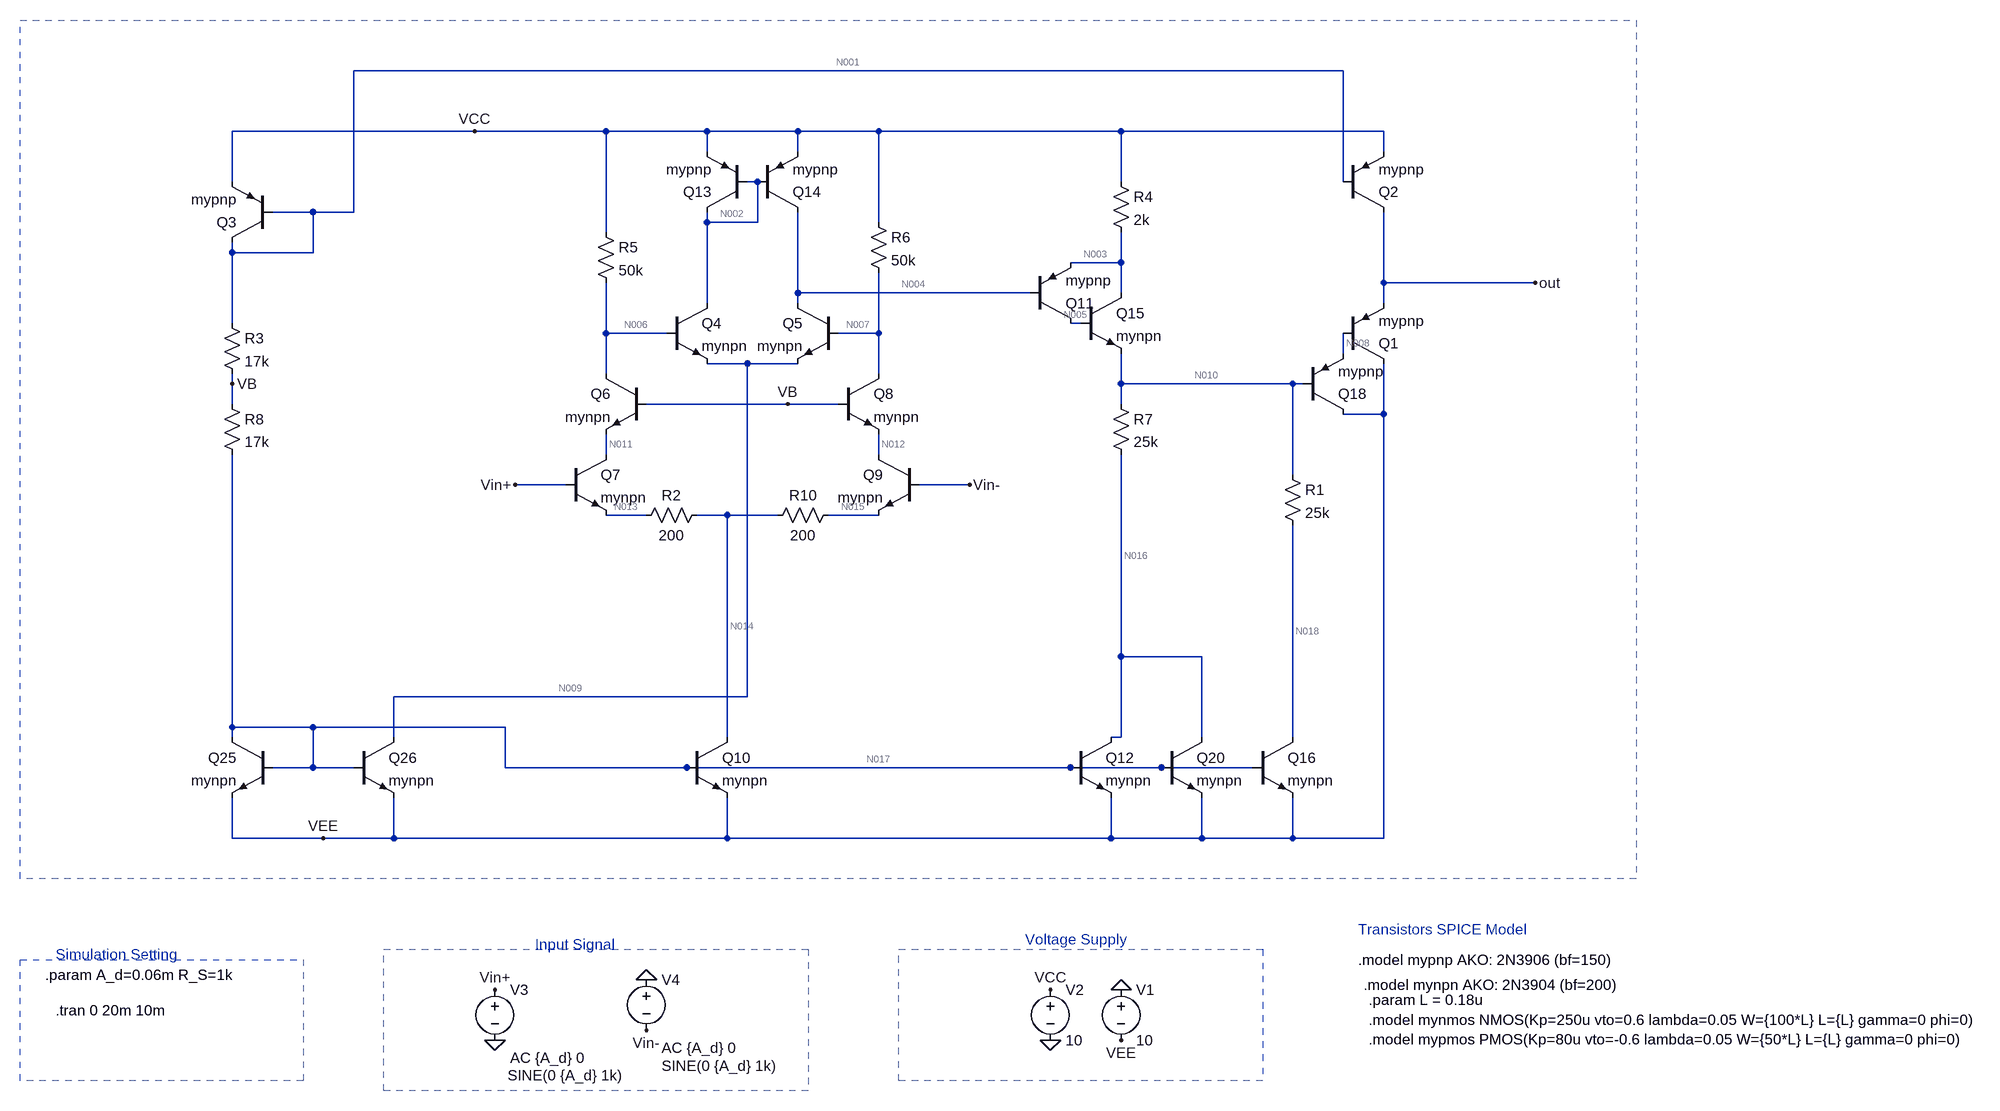
[diagram p0: schematic main.asc]
main.asc, the LTspice schematic file:
Version 4.1
SHEET 1 2940 1112
WIRE 1296 -512 -272 -512
WIRE -80 -416 -464 -416
WIRE 128 -416 -80 -416
WIRE 288 -416 128 -416
WIRE 432 -416 288 -416
WIRE 560 -416 432 -416
WIRE 944 -416 560 -416
WIRE 1360 -416 944 -416
WIRE 288 -384 288 -416
WIRE 432 -384 432 -416
WIRE 1360 -384 1360 -416
WIRE -464 -336 -464 -416
WIRE 368 -336 352 -336
WIRE 944 -336 944 -416
WIRE 1296 -336 1296 -512
WIRE -336 -288 -400 -288
WIRE -272 -288 -272 -512
WIRE -272 -288 -336 -288
WIRE 288 -272 288 -288
WIRE 368 -272 368 -336
WIRE 368 -272 288 -272
WIRE 560 -272 560 -416
WIRE 128 -256 128 -416
WIRE -464 -224 -464 -240
WIRE -336 -224 -336 -288
WIRE -336 -224 -464 -224
WIRE 944 -208 944 -256
WIRE 944 -208 864 -208
WIRE 1360 -176 1360 -288
WIRE 1600 -176 1360 -176
WIRE 432 -160 432 -288
WIRE 800 -160 432 -160
WIRE 944 -160 944 -208
WIRE 288 -144 288 -272
WIRE 432 -144 432 -160
WIRE 1360 -144 1360 -176
WIRE -464 -112 -464 -224
WIRE 880 -112 864 -112
WIRE 128 -96 128 -176
WIRE 224 -96 128 -96
WIRE 560 -96 560 -192
WIRE 560 -96 496 -96
WIRE 1296 -64 1296 -96
WIRE 352 -48 288 -48
WIRE 432 -48 352 -48
WIRE 128 -32 128 -96
WIRE 560 -32 560 -96
WIRE -464 -16 -464 -32
WIRE 944 -16 944 -64
WIRE 1216 -16 944 -16
WIRE 1232 -16 1216 -16
WIRE -464 16 -464 -16
WIRE 416 16 192 16
WIRE 496 16 416 16
WIRE 944 16 944 -16
WIRE 1360 32 1360 -48
WIRE 1360 32 1296 32
WIRE 128 96 128 64
WIRE 560 96 560 64
WIRE 1216 128 1216 -16
WIRE 64 144 -16 144
WIRE 704 144 624 144
WIRE 192 192 128 192
WIRE 320 192 272 192
WIRE 400 192 320 192
WIRE 560 192 480 192
WIRE 944 416 944 96
WIRE 1072 416 944 416
WIRE 352 480 352 -48
WIRE 352 480 -208 480
WIRE -464 528 -464 96
WIRE -336 528 -464 528
WIRE -32 528 -336 528
WIRE -464 544 -464 528
WIRE -208 544 -208 480
WIRE 320 544 320 192
WIRE 944 544 944 416
WIRE 944 544 928 544
WIRE 1072 544 1072 416
WIRE 1216 544 1216 208
WIRE -336 592 -336 528
WIRE -336 592 -400 592
WIRE -272 592 -336 592
WIRE -32 592 -32 528
WIRE 256 592 -32 592
WIRE 864 592 256 592
WIRE 1008 592 864 592
WIRE 1152 592 1008 592
WIRE -464 704 -464 640
WIRE -320 704 -464 704
WIRE -208 704 -208 640
WIRE -208 704 -320 704
WIRE 320 704 320 640
WIRE 320 704 -208 704
WIRE 928 704 928 640
WIRE 928 704 320 704
WIRE 1072 704 1072 640
WIRE 1072 704 928 704
WIRE 1216 704 1216 640
WIRE 1216 704 1072 704
WIRE 1360 704 1360 32
WIRE 1360 704 1216 704
FLAG 944 1024 VEE
FLAG 832 944 VCC
FLAG 832 1024 0
FLAG 944 944 0
FLAG -48 1024 0
FLAG -48 944 Vin+
FLAG -320 704 VEE
FLAG -80 -416 VCC
FLAG 416 16 VB
FLAG -464 -16 VB
FLAG -16 144 Vin+
FLAG 704 144 Vin-
FLAG 1600 -176 out
FLAG 192 928 0
FLAG 192 1008 Vin-
SYMBOL voltage 944 928 R0
WINDOW 123 0 0 Left 0
WINDOW 39 0 0 Left 0
SYMATTR InstName V1
SYMATTR Value 10
SYMBOL voltage 832 928 R0
WINDOW 123 0 0 Left 0
WINDOW 39 0 0 Left 0
SYMATTR InstName V2
SYMATTR Value 10
SYMBOL voltage -48 928 R0
WINDOW 123 24 124 Left 2
WINDOW 39 0 0 Left 0
WINDOW 3 20 151 Left 2
SYMATTR Value2 AC {A_d} 0
SYMATTR Value SINE(0 {A_d} 1k)
SYMATTR InstName V3
SYMBOL voltage 192 912 R0
WINDOW 123 24 124 Left 2
WINDOW 39 0 0 Left 0
WINDOW 3 24 152 Left 2
SYMATTR Value2 AC {A_d} 0
SYMATTR Value SINE(0 {A_d} 1k)
SYMATTR InstName V4
SYMBOL npn -400 544 M0
SYMATTR InstName Q25
SYMATTR Value mynpn
SYMBOL npn -272 544 R0
SYMATTR InstName Q26
SYMATTR Value mynpn
SYMBOL pnp -400 -240 R180
SYMATTR InstName Q3
SYMATTR Value mypnp
SYMBOL npn 224 -144 R0
SYMATTR InstName Q4
SYMATTR Value mynpn
SYMBOL npn 496 -144 M0
SYMATTR InstName Q5
SYMATTR Value mynpn
SYMBOL npn 192 -32 M0
SYMATTR InstName Q6
SYMATTR Value mynpn
SYMBOL npn 64 96 R0
SYMATTR InstName Q7
SYMATTR Value mynpn
SYMBOL npn 496 -32 R0
SYMATTR InstName Q8
SYMATTR Value mynpn
SYMBOL npn 624 96 M0
SYMATTR InstName Q9
SYMATTR Value mynpn
SYMBOL npn 256 544 R0
SYMATTR InstName Q10
SYMATTR Value mynpn
SYMBOL res 112 -272 R0
SYMATTR InstName R5
SYMATTR Value 50k
SYMBOL res 544 -288 R0
SYMATTR InstName R6
SYMATTR Value 50k
SYMBOL npn 864 544 R0
SYMATTR InstName Q12
SYMATTR Value mynpn
SYMBOL pnp 352 -288 R180
SYMATTR InstName Q13
SYMATTR Value mypnp
SYMBOL pnp 368 -288 M180
SYMATTR InstName Q14
SYMATTR Value mypnp
SYMBOL pnp 800 -112 M180
SYMATTR InstName Q11
SYMATTR Value mypnp
SYMBOL npn 880 -160 R0
SYMATTR InstName Q15
SYMATTR Value mynpn
SYMBOL res 928 -352 R0
SYMATTR InstName R4
SYMATTR Value 2k
SYMBOL res 928 0 R0
SYMATTR InstName R7
SYMATTR Value 25k
SYMBOL res -480 -128 R0
SYMATTR InstName R3
SYMATTR Value 17k
SYMBOL res -480 0 R0
SYMATTR InstName R8
SYMATTR Value 17k
SYMBOL npn 1008 544 R0
SYMATTR InstName Q20
SYMATTR Value mynpn
SYMBOL pnp 1296 -288 M180
SYMATTR InstName Q2
SYMATTR Value mypnp
SYMBOL npn 1152 544 R0
SYMATTR InstName Q16
SYMATTR Value mynpn
SYMBOL res 1200 112 R0
SYMATTR InstName R1
SYMATTR Value 25k
SYMBOL res 288 176 R90
WINDOW 0 0 56 VBottom 2
WINDOW 3 32 56 VTop 2
SYMATTR InstName R2
SYMATTR Value 200
SYMBOL res 496 176 R90
WINDOW 0 0 56 VBottom 2
WINDOW 3 32 56 VTop 2
SYMATTR InstName R10
SYMATTR Value 200
SYMBOL pnp 1296 -48 M180
SYMATTR InstName Q1
SYMATTR Value mypnp
SYMBOL pnp 1232 32 M180
SYMATTR InstName Q18
SYMATTR Value mypnp
TEXT 1320 896 Left 2 !.model mypnp AKO: 2N3906 (bf=150)
TEXT 1328 936 Left 2 !.model mynpn AKO: 2N3904 (bf=200)
TEXT 1336 960 Left 2 !.param L = 0.18u\n.model mynmos NMOS(Kp=250u vto=0.6 lambda=0.05 W={100*L} L={L} gamma=0 phi=0)\n.model mypmos PMOS(Kp=80u vto=-0.6 lambda=0.05 W={50*L} L={L} gamma=0 phi=0)
TEXT -760 920 Left 2 !.param A_d=0.06m R_S=1k
TEXT -744 888 Left 2 ;Simulation Setting
TEXT 16 872 Left 2 ;Input Signal
TEXT 792 864 Left 2 ;Voltage Supply
TEXT 1320 848 Left 2 ;Transistors SPICE Model
TEXT -744 976 Left 2 !.tran 0 20m 10m
RECTANGLE Normal 1760 768 -800 -592 4
RECTANGLE Normal -352 1088 -800 896 2
RECTANGLE Normal 448 1104 -224 880 2
RECTANGLE Normal 1168 1088 592 880 2

The netlist it stands for:
* main.asc
V1 0 VEE 10
V2 VCC 0 10
V3 Vin+ 0 SINE(0 {A_d} 1k) AC {A_d} 0
V4 0 Vin- SINE(0 {A_d} 1k) AC {A_d} 0
Q25 N017 N017 VEE 0 mynpn
Q26 N009 N017 VEE 0 mynpn
Q3 N001 N001 VCC 0 mypnp
Q4 N002 N006 N009 0 mynpn
Q5 N004 N007 N009 0 mynpn
Q6 N006 VB N011 0 mynpn
Q7 N011 Vin+ N013 0 mynpn
Q8 N007 VB N012 0 mynpn
Q9 N012 Vin- N015 0 mynpn
Q10 N014 N017 VEE 0 mynpn
R5 VCC N006 50k
R6 VCC N007 50k
Q12 N016 N017 VEE 0 mynpn
Q13 N002 N002 VCC 0 mypnp
Q14 N004 N002 VCC 0 mypnp
Q11 N005 N004 N003 0 mypnp
Q15 N003 N005 N010 0 mynpn
R4 VCC N003 2k
R7 N010 N016 25k
R3 N001 VB 17k
R8 VB N017 17k
Q20 N016 N017 VEE 0 mynpn
Q2 out N001 VCC 0 mypnp
Q16 N018 N017 VEE 0 mynpn
R1 N010 N018 25k
R2 N014 N013 200
R10 N015 N014 200
Q1 VEE N008 out 0 mypnp
Q18 VEE N010 N008 0 mypnp
.model NPN NPN
.model PNP PNP
.lib standard.bjt
.model mypnp AKO: 2N3906 (bf=150)
.model mynpn AKO: 2N3904 (bf=200)
.param L = 0.18u
.model mynmos NMOS(Kp=250u vto=0.6 lambda=0.05 W={100*L} L={L} gamma=0 phi=0)
.model mypmos PMOS(Kp=80u vto=-0.6 lambda=0.05 W={50*L} L={L} gamma=0 phi=0)
.param A_d=0.06m R_S=1k
* Simulation Setting
* Input Signal
* Voltage Supply
* Transistors SPICE Model
.tran 0 20m 10m
.backanno
.end

* Results of the author's LTspice run, read from the files saved beside the schematic
* Operating Point, zero values left out:
*   V(n001) = 9.36 V
*   V(n002) = 9.385 V
*   V(n003) = 9.19 V
*   V(n004) = 8.702 V
*   V(n005) = -4.292 V
*   V(n006) = 2.626 V
*   V(n007) = 2.626 V
*   V(n008) = -4.41 V
*   V(n009) = 2.012 V
*   V(n010) = -4.92 V
*   V(n011) = -621.2 mV
*   V(n012) = -621.2 mV
*   V(n013) = -636.9 mV
*   V(n014) = -679.6 mV
*   V(n015) = -636.9 mV
*   V(n016) = -9.986 V
*   V(n017) = -9.369 V
*   V(n018) = -9.975 V
*   V(out) = -3.769 V
*   V(vb) = -16.38 mV
*   V(vcc) = 10 V
*   V(vee) = -10 V
*   I(R1) = 202.2 µA
*   I(R10) = 213.5 µA
*   I(R2) = -213.5 µA
*   I(R3) = 551.6 µA
*   I(R4) = 404.8 µA
*   I(R5) = 147.5 µA
*   I(R6) = 147.5 µA
*   I(R7) = 202.6 µA
*   I(R8) = 550.2 µA
*   I(V1) = -2.435 mA
*   I(V2) = -2.302 mA
*   I(V3) = -66.31 µA
*   I(V4) = 66.31 µA
*   Ib(Q1) = -3.868 µA
*   Ib(Q10) = 1.966 µA
*   Ib(Q11) = -10.47 nA
*   Ib(Q12) = 56.85 µA
*   Ib(Q13) = -1.438 µA
*   Ib(Q14) = -1.438 µA
*   Ib(Q15) = 1.777 µA
*   Ib(Q16) = 37.69 µA
*   Ib(Q18) = -24.38 nA
*   Ib(Q2) = -3.633 µA
*   Ib(Q20) = 56.85 µA
*   Ib(Q25) = 1.966 µA
*   Ib(Q26) = 1.966 µA
*   Ib(Q3) = -3.634 µA
*   Ib(Q4) = 1.023 µA
*   Ib(Q5) = 1.023 µA
*   Ib(Q6) = 713.7 nA
*   Ib(Q7) = 66.31 µA
*   Ib(Q8) = 713.7 nA
*   Ib(Q9) = 66.31 µA
*   Ic(Q1) = -611.7 µA
*   Ic(Q10) = 426.9 µA
*   Ic(Q11) = -1.777 µA
*   Ic(Q12) = 101.3 µA
*   Ic(Q13) = -215.5 µA
*   Ic(Q14) = -217 µA
*   Ic(Q15) = 403 µA
*   Ic(Q16) = 202.2 µA
*   Ic(Q18) = -3.844 µA
*   Ic(Q2) = -615.6 µA
*   Ic(Q20) = 101.3 µA
*   Ic(Q25) = 392.9 µA
*   Ic(Q26) = 437.5 µA
*   Ic(Q3) = -544.3 µA
*   Ic(Q4) = 218.4 µA
*   Ic(Q5) = 217 µA
*   Ic(Q6) = 146.5 µA
*   Ic(Q7) = 147.2 µA
*   Ic(Q8) = 146.5 µA
*   Ic(Q9) = 147.2 µA
*   Ie(Q1) = 615.6 µA
*   Ie(Q10) = -428.9 µA
*   Ie(Q11) = 1.788 µA
*   Ie(Q12) = -158.2 µA
*   Ie(Q13) = 217 µA
*   Ie(Q14) = 218.5 µA
*   Ie(Q15) = -404.8 µA
*   Ie(Q16) = -239.9 µA
*   Ie(Q18) = 3.868 µA
*   Ie(Q2) = 619.2 µA
*   Ie(Q20) = -158.2 µA
*   Ie(Q25) = -394.8 µA
*   Ie(Q26) = -439.5 µA
*   Ie(Q3) = 547.9 µA
*   Ie(Q4) = -219.4 µA
*   Ie(Q5) = -218.1 µA
*   Ie(Q6) = -147.2 µA
*   Ie(Q7) = -213.5 µA
*   Ie(Q8) = -147.2 µA
*   Ie(Q9) = -213.5 µA
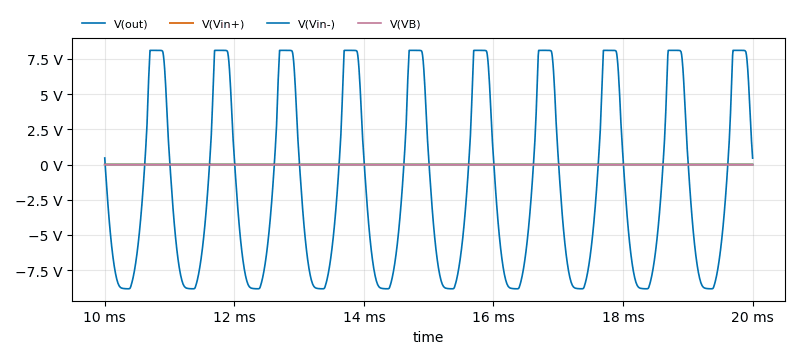
[diagram p1: Transient Analysis of main.asc, plotted from the saved traces]
* Transient Analysis, 1 run:
*   V(out): min -8.823 V, max 8.102 V, average -1.52 V, rms 6.848 V, last 451 mV
*   V(Vin+): min -60 µV, max 60 µV, average -1.52 nV, rms 42.43 µV, last 0 V
*   V(Vin-): min -60 µV, max 60 µV, average 1.52 nV, rms 42.43 µV, last 0 V
*   V(VB): min -17.14 mV, max -15.94 mV, average -16.5 mV, rms 16.5 mV, last -15.95 mV